# Altium schematic sheet BIA2.SchDoc
size A3
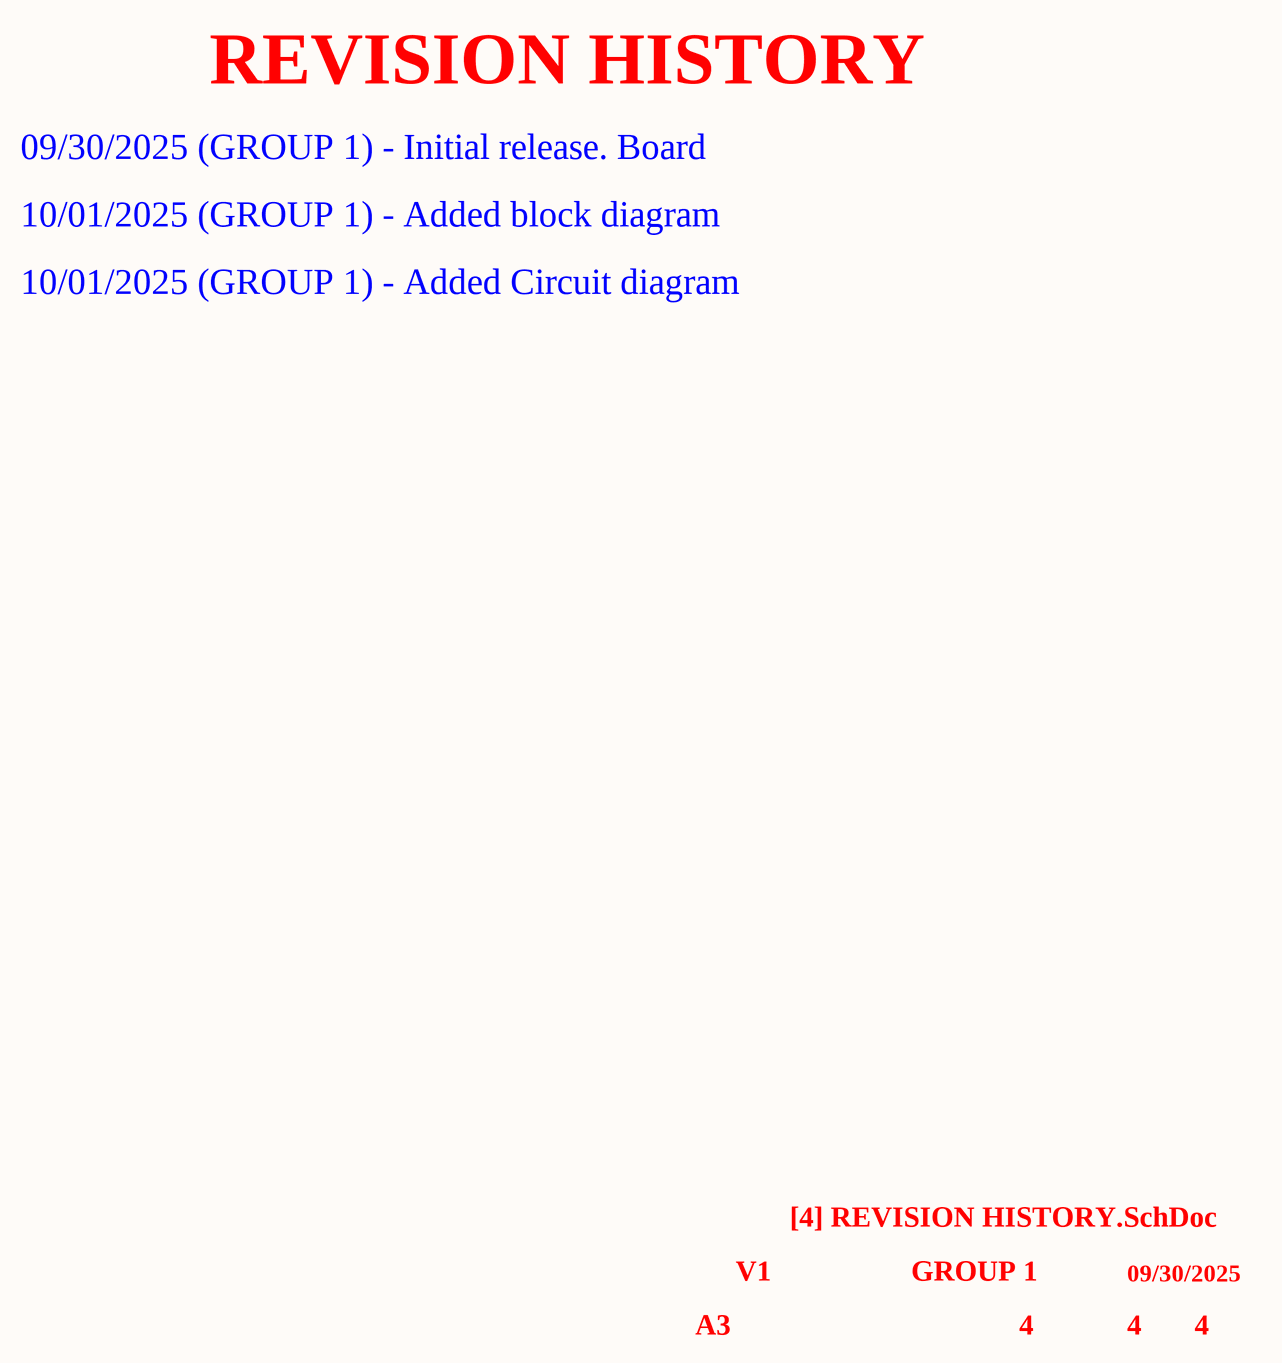
[diagram p0: BIA2.SchDoc]

## Notes on the sheet
- REVISION HISTORY
- 09/30/2025 (GROUP 1) - Initial release. Board
- 10/01/2025 (GROUP 1) - Added block diagram
- 10/01/2025 (GROUP 1) - Added Circuit diagram
- [4] REVISION HISTORY.SchDoc
- A3
- V1
- GROUP 1
- 4
- 09/30/2025
- Project:
- Digital_Clock.PrjPcb
- Page Contents:
- Revision:
- Size:
- Design:
- Document number:
- Date:
- Sheet
- of